# Altium schematic sheet 7219.SchDoc
size A4
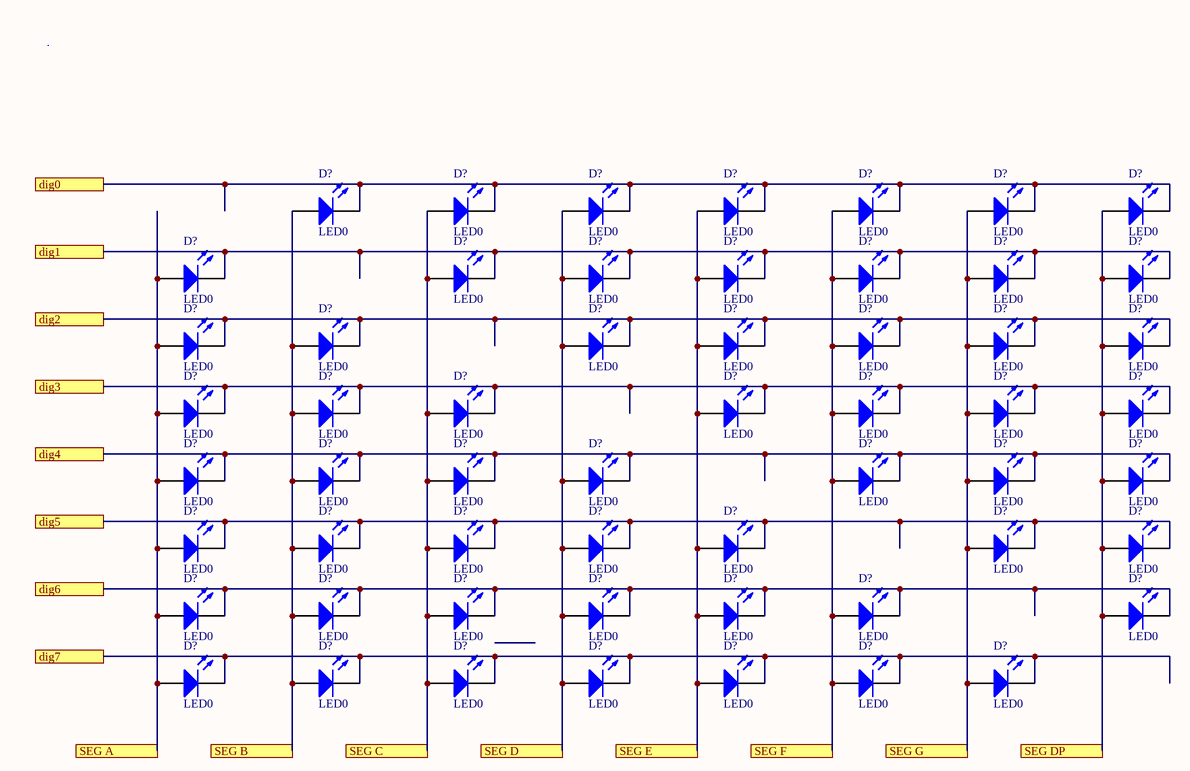
[diagram p0: 7219.SchDoc]

## Parts
(Parts that share a designator on the sheet are numbered #1, #2 ... from top to bottom, then left to right.)
D?#1  LED0  [LED-0]
D?#2  LED0  [LED-0]
D?#3  LED0  [LED-0]
D?#4  LED0  [LED-0]
D?#5  LED0  [LED-0]
D?#6  LED0  [LED-0]
D?#7  LED0  [LED-0]
D?#8  LED0  [LED-0]
D?#9  LED0  [LED-0]
D?#10  LED0  [LED-0]
D?#11  LED0  [LED-0]
D?#12  LED0  [LED-0]
D?#13  LED0  [LED-0]
D?#14  LED0  [LED-0]
D?#15  LED0  [LED-0]
D?#16  LED0  [LED-0]
D?#17  LED0  [LED-0]
D?#18  LED0  [LED-0]
D?#19  LED0  [LED-0]
D?#20  LED0  [LED-0]
D?#21  LED0  [LED-0]
D?#22  LED0  [LED-0]
D?#23  LED0  [LED-0]
D?#24  LED0  [LED-0]
D?#25  LED0  [LED-0]
D?#26  LED0  [LED-0]
D?#27  LED0  [LED-0]
D?#28  LED0  [LED-0]
D?#29  LED0  [LED-0]
D?#30  LED0  [LED-0]
D?#31  LED0  [LED-0]
D?#32  LED0  [LED-0]
D?#33  LED0  [LED-0]
D?#34  LED0  [LED-0]
D?#35  LED0  [LED-0]
D?#36  LED0  [LED-0]
D?#37  LED0  [LED-0]
D?#38  LED0  [LED-0]
D?#39  LED0  [LED-0]
D?#40  LED0  [LED-0]
D?#41  LED0  [LED-0]
D?#42  LED0  [LED-0]
D?#43  LED0  [LED-0]
D?#44  LED0  [LED-0]
D?#45  LED0  [LED-0]
D?#46  LED0  [LED-0]
D?#47  LED0  [LED-0]
D?#48  LED0  [LED-0]
D?#49  LED0  [LED-0]
D?#50  LED0  [LED-0]
D?#51  LED0  [LED-0]
D?#52  LED0  [LED-0]
D?#53  LED0  [LED-0]
D?#54  LED0  [LED-0]
D?#55  LED0  [LED-0]
D?#56  LED0  [LED-0]

## Ports
dig0, dig1, dig2, dig3, dig4, dig5, dig6, dig7, SEG A, SEG B, SEG C, SEG D, SEG DP, SEG E, SEG F, SEG G

## Nets
dig0: D?#1.2(K) D?#2.2(K) D?#3.2(K) D?#4.2(K) D?#5.2(K) D?#6.2(K) D?#7.2(K) ; port dig0
dig1: D?#8.2(K) D?#9.2(K) D?#10.2(K) D?#11.2(K) D?#12.2(K) D?#13.2(K) D?#14.2(K) ; port dig1
dig2: D?#15.2(K) D?#16.2(K) D?#17.2(K) D?#18.2(K) D?#19.2(K) D?#20.2(K) D?#21.2(K) ; port dig2
dig3: D?#22.2(K) D?#23.2(K) D?#24.2(K) D?#25.2(K) D?#26.2(K) D?#27.2(K) D?#28.2(K) ; port dig3
dig4: D?#29.2(K) D?#30.2(K) D?#31.2(K) D?#32.2(K) D?#33.2(K) D?#34.2(K) D?#35.2(K) ; port dig4
dig5: D?#36.2(K) D?#37.2(K) D?#38.2(K) D?#39.2(K) D?#40.2(K) D?#41.2(K) D?#42.2(K) ; port dig5
dig6: D?#43.2(K) D?#44.2(K) D?#45.2(K) D?#46.2(K) D?#47.2(K) D?#48.2(K) D?#49.2(K) ; port dig6
dig7: D?#50.2(K) D?#51.2(K) D?#52.2(K) D?#53.2(K) D?#54.2(K) D?#55.2(K) D?#56.2(K) ; port dig7
SEG A: D?#8.1(A) D?#15.1(A) D?#22.1(A) D?#29.1(A) D?#36.1(A) D?#43.1(A) D?#50.1(A) ; port SEG A
SEG B: D?#1.1(A) D?#16.1(A) D?#23.1(A) D?#30.1(A) D?#37.1(A) D?#44.1(A) D?#51.1(A) ; port SEG B
SEG C: D?#2.1(A) D?#9.1(A) D?#24.1(A) D?#31.1(A) D?#38.1(A) D?#45.1(A) D?#52.1(A) ; port SEG C
SEG D: D?#3.1(A) D?#10.1(A) D?#17.1(A) D?#32.1(A) D?#39.1(A) D?#46.1(A) D?#53.1(A) ; port SEG D
SEG DP: D?#7.1(A) D?#14.1(A) D?#21.1(A) D?#28.1(A) D?#35.1(A) D?#42.1(A) D?#49.1(A) ; port SEG DP
SEG E: D?#4.1(A) D?#11.1(A) D?#18.1(A) D?#25.1(A) D?#40.1(A) D?#47.1(A) D?#54.1(A) ; port SEG E
SEG F: D?#5.1(A) D?#12.1(A) D?#19.1(A) D?#26.1(A) D?#33.1(A) D?#48.1(A) D?#55.1(A) ; port SEG F
SEG G: D?#6.1(A) D?#13.1(A) D?#20.1(A) D?#27.1(A) D?#34.1(A) D?#41.1(A) D?#56.1(A) ; port SEG G

## Library data of the parts
D?#1-D?#56 = LED0: Typical INFRARED GaAs LED; Published: 8-Jun-2000; LatestRevisionDate: 08-Jul-2005; LatestRevisionNote: Mech Layer 1 removed.; PackageReference: LED-0; Publisher: Altium Limited; PackageDescription: LED; 2 Leads